# EAGLE design phMeter v4.2 (EAGLE 7.1.0)
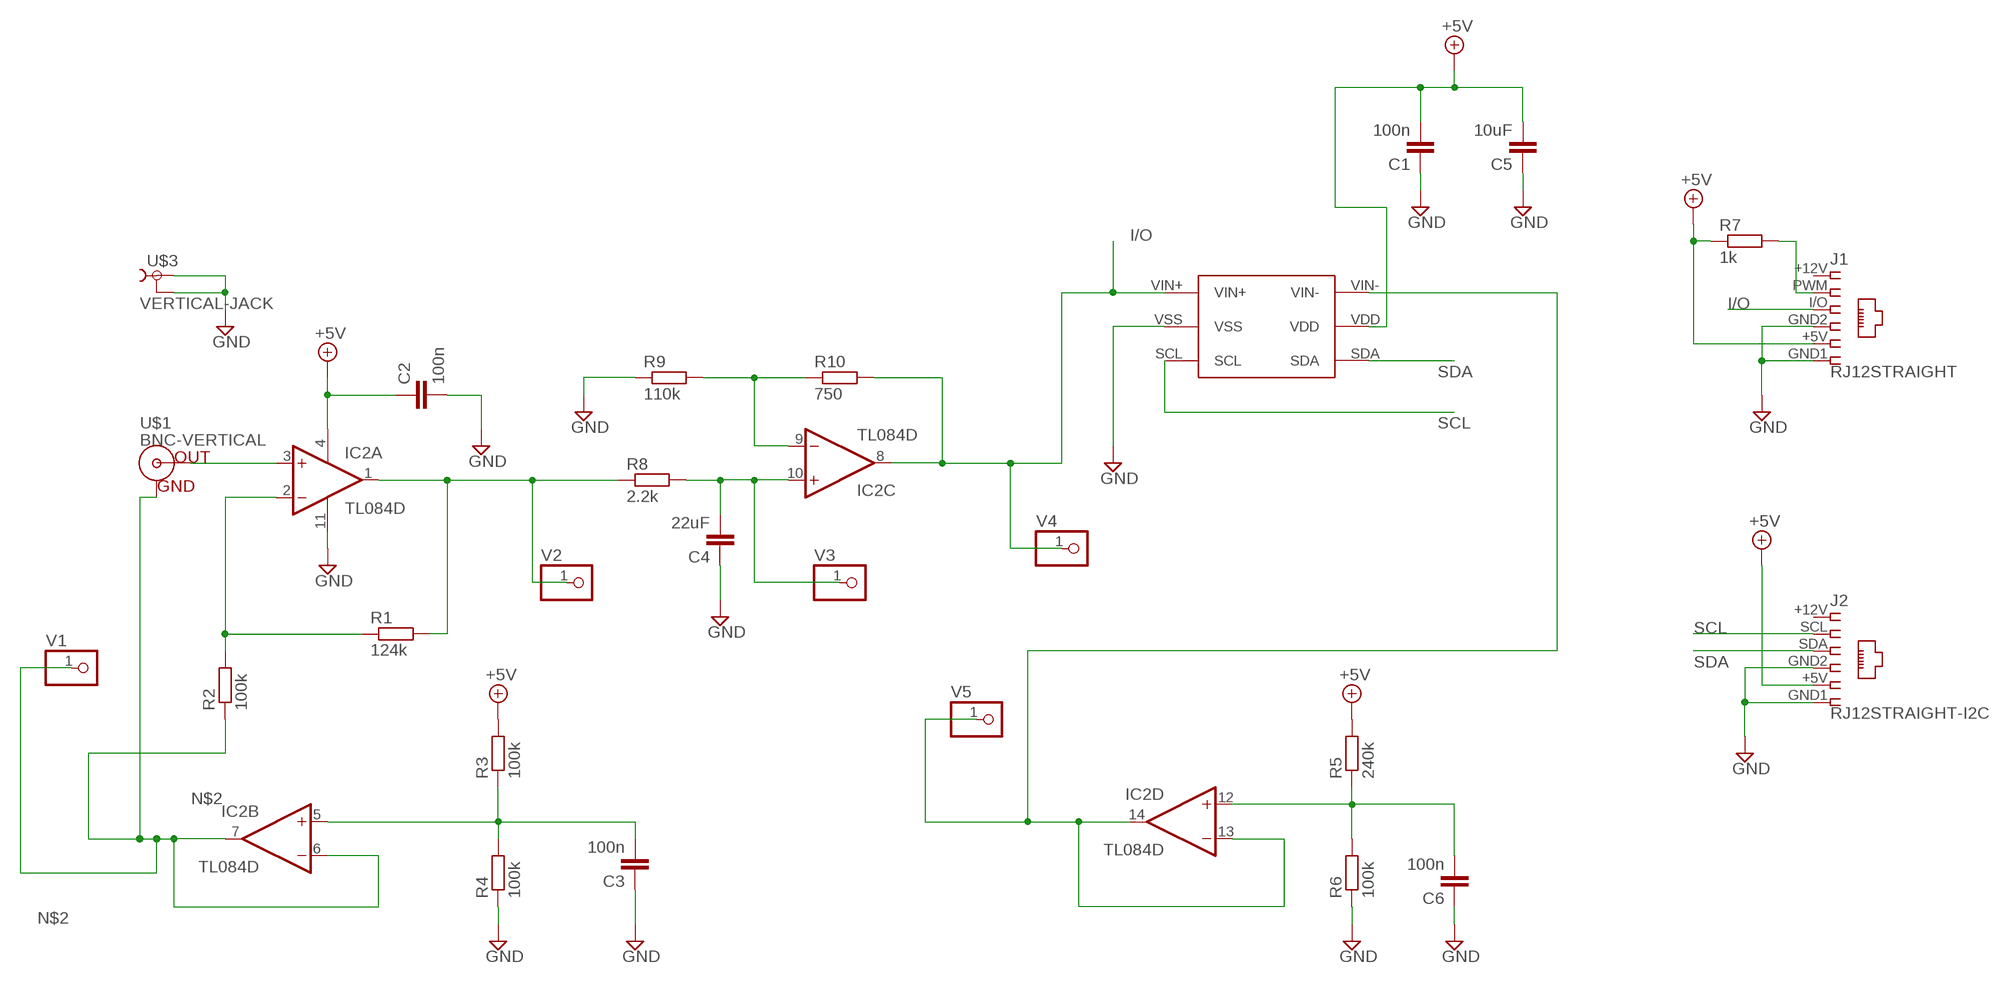
[diagram p0: schematic, sheet 1]

## Parts
C1  100n  C-EUC1206  [C1206]
C2  100n  C-EUC1206  [C1206]
C3  100n  C-EUC1206  [C1206]
C4  22uF  C-EUC1206  [C1206]
C5  10uF  C-EUC1206  [C1206]
C6  100n  C-EUC1206  [C1206]
IC2  TL084D  [SO14]
J1  RJ12STRAIGHT  [RJ12-STRAIGHT]
J2  RJ12STRAIGHT-I2C  [RJ12-STRAIGHT-I2C]
R1  124k  R-EU_R1206  [R1206]
R2  100k  R-EU_R1206  [R1206]
R3  100k  R-EU_R1206  [R1206]
R4  100k  R-EU_R1206  [R1206]
R5  240k  R-EU_R1206  [R1206]
R6  100k  R-EU_R1206  [R1206]
R7  1k  R-EU_R1206  [R1206]
R8  2.2k  R-EU_R1206  [R1206]
R9  110k  R-EU_R1206  [R1206]
R10  750  R-EU_R1206  [R1206]
U$1  BNC-VERTICAL  [BNC-VERTICAL]
U$3  VERTICAL-JACK  [VERTICAL-JACK]
U$5  MCP3425  [SOT-23-6]
V1  PINHD-1X1  [1X01]
V2  PINHD-1X1  [1X01]
V3  PINHD-1X1  [1X01]
V4  PINHD-1X1  [1X01]
V5  PINHD-1X1  [1X01]

## Nets
+5V: C1.2 C2.1 C5.2 IC2.4(P:V+) J1.+5V J2.+5V R3.2 R5.2 R7.1 U$5.VDD
GND: C1.1 C2.2 C3.1 C4.1 C5.1 C6.1 IC2.11(P:V-) J1.GND1 J1.GND2 J2.GND1 J2.GND2 R4.1 R6.1 R9.1 U$3.P$1 U$3.P$2 U$5.VSS
I/O: IC2.8(C:OUT) J1.I/O R10.2 U$5.VIN+ V4.1
N$1: IC2.2(A:-IN) R1.1 R2.2
N$2: IC2.6(B:-IN) IC2.7(B:OUT) R2.1 U$1.G(GND) V1.1
N$3: J1.PWM R7.2
N$4: IC2.13(D:-IN) IC2.14(D:OUT) U$5.VIN- V5.1
N$5: IC2.3(A:+IN) U$1.S(OUT)
N$7: IC2.1(A:OUT) R1.2 R8.1 V2.1
N$9: C3.2 IC2.5(B:+IN) R3.1 R4.2
N$10: C4.2 IC2.10(C:+IN) R8.2 V3.1
N$11: IC2.9(C:-IN) R9.2 R10.1
N$14: C6.2 IC2.12(D:+IN) R5.1 R6.2
SCL: J2.SCL U$5.SCL
SDA: J2.SDA U$5.SDA
Unconnected: J1.+12V J2.+12V

## Library data of the parts
C1-C6 = rcl:C-EU: CAPACITOR, European symbol
IC2 = linear:TL084: OP AMP
J1 J2 = lpatiny:RJ12: CORCOM Modular RJ Jacks No Shield Source: www.tycoelectronics.com .. ENG_DS_1654001_1099_RJ_L_0507.pdf
R1-R10 = resistor:R-EU_: RESISTOR, European symbol
U$1 = phMeter:BNC-VERTICAL
U$3 = phMeter:VERTICAL-JACK
U$5 = phMeter:MCP3425
V1-V5 = pinhead:PINHD-1X1: PIN HEADER

## Net classes
0 default: width 0.457 mm

## Board
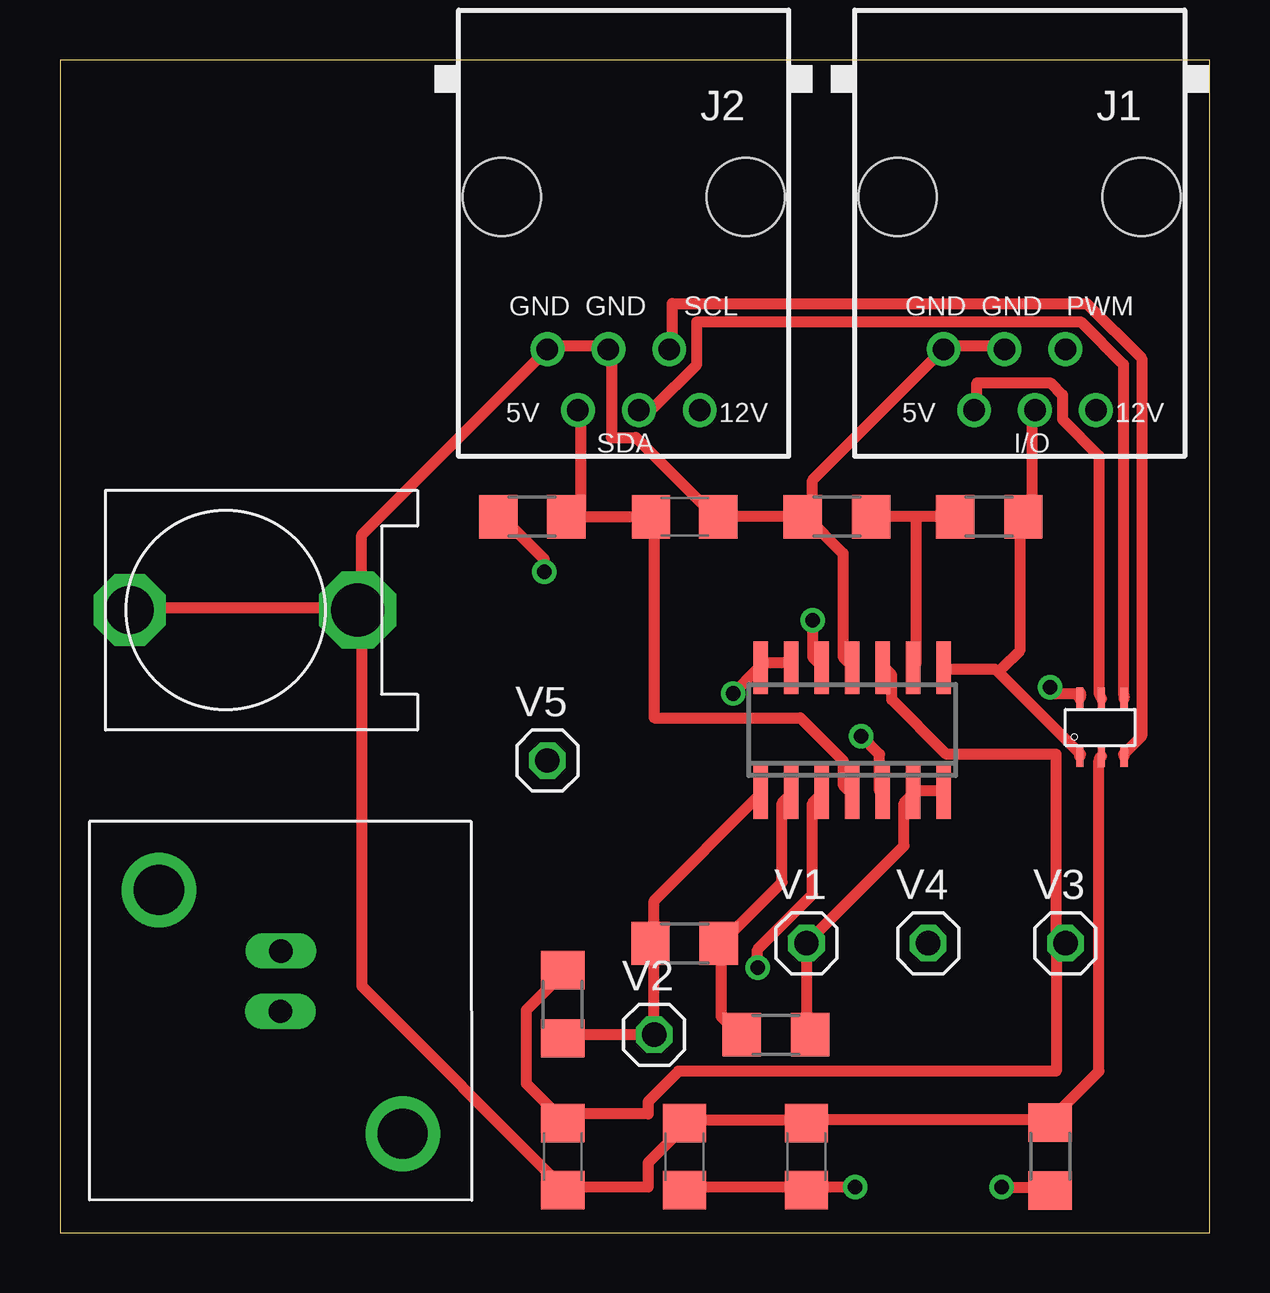
[diagram p1: board, top side]
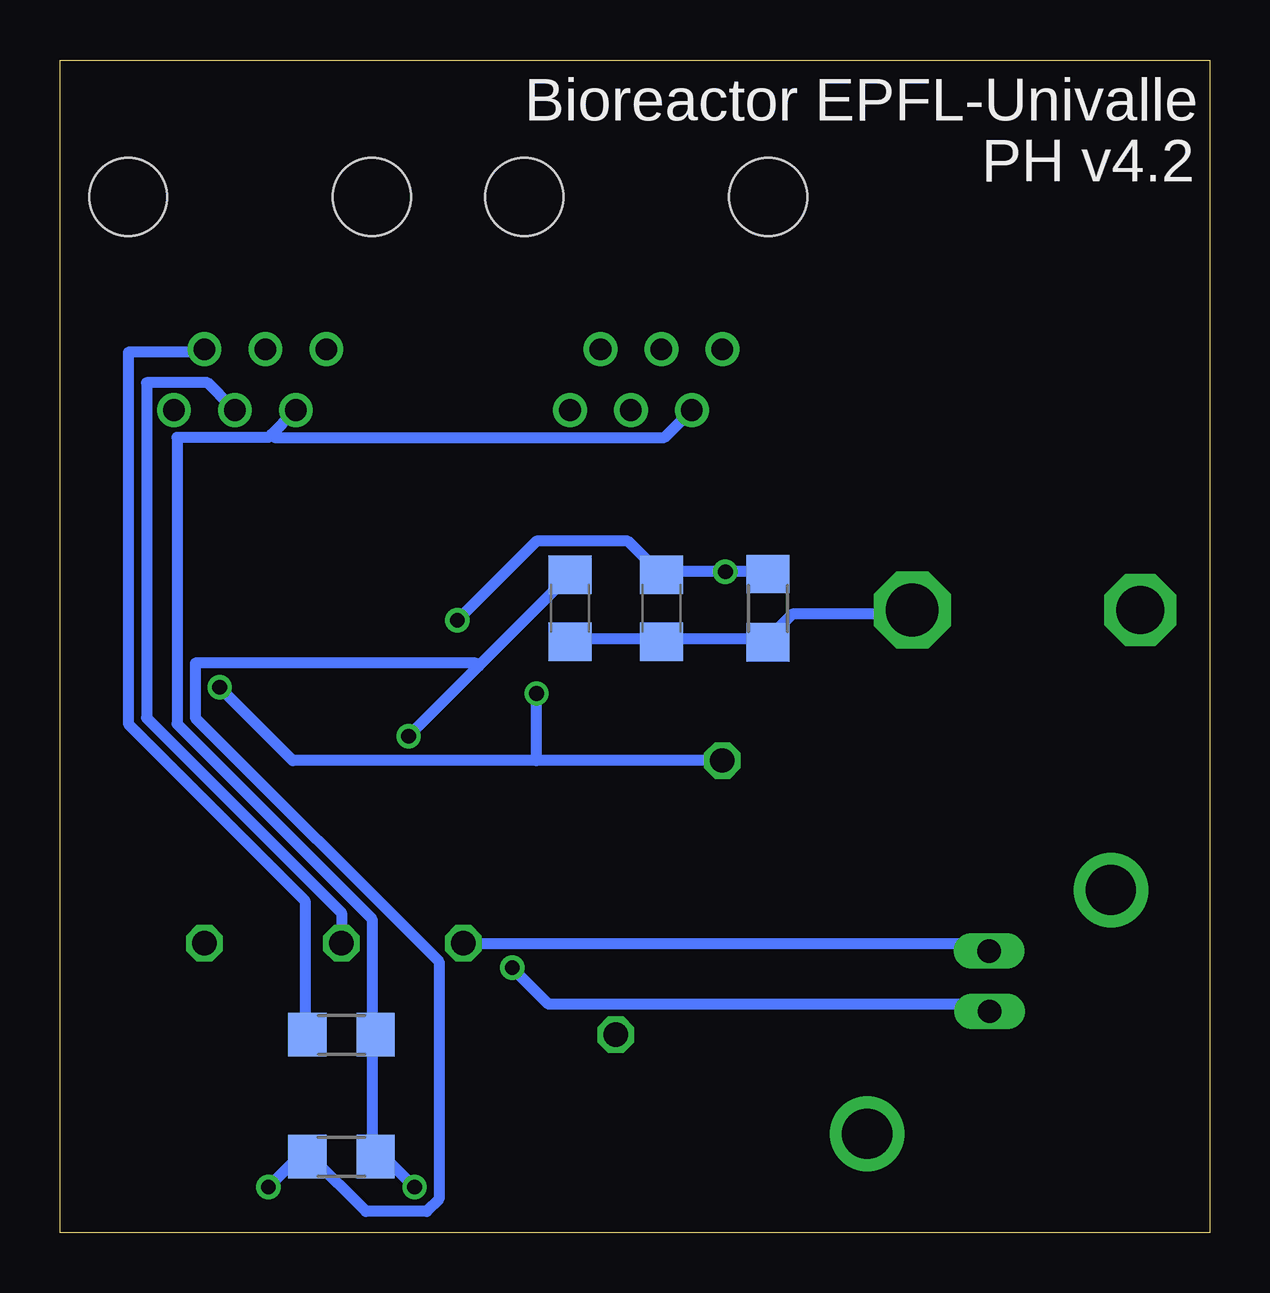
[diagram p2: board, bottom side, seen from below]

Size 47.93 x 48.89 mm. Coordinates in mm from the lower left corner, seen from the top.
Outline: 0,0 47.93,0 47.93,48.89 0,48.89 0,0
Copper layers (1*16): Top 0.035mm / dielectric 1.5mm / Bottom 0.035mm
Design rules "default": minimum track width 10mil, minimum drill 24mil, track to track 8mil, track to pad 8mil, pad to pad 8mil, via to via 8mil, smd to smd 8mil, copper to edge 40mil, drill to drill 8mil, minimum pad ring 10mil, minimum via ring 8mil, stop-mask expansion 4mil, vias tented up to drill 0mil, thermal gap 10mil

### Footprints (pad centres in the part's own frame; a part is rotated, then mirrored left to right if it is on the bottom)
C1206 = smd 1.6 x 1.8: 1 -1.4,0; 2 1.4,0
SO14 = smd 0.6 x 2.2: 1 -3.81,-2.6; 2 -2.54,-2.6; 3 -1.27,-2.6; 4 0,-2.6; 5 1.27,-2.6; 6 2.54,-2.6; 7 3.81,-2.6; 8 3.81,2.6; 9 2.54,2.6; 10 1.27,2.6; 11 0,2.6; 12 -1.27,2.6; 13 -2.54,2.6; 14 -3.81,2.6
RJ12-STRAIGHT = drill 0.9 pad 1.4: +5V 1.905,8.89; +12V -3.175,8.89; GND1 3.175,6.35; GND2 0.635,6.35; I/O -0.635,8.89; PWM -1.905,6.35 | hole 3.251: -5.08,0; 5.08,0
RJ12-STRAIGHT-I2C = drill 0.9 pad 1.4: +5V 1.905,8.89; +12V -3.175,8.89; GND1 3.175,6.35; GND2 0.635,6.35; SCL -1.905,6.35; SDA -0.635,8.89 | hole 3.251: -5.08,0; 5.08,0
R1206 = smd 1.6 x 1.803: 1 -1.422,0; 2 1.422,0
BNC-VERTICAL = drill 0.97 long: G 5.4,-7.94; S 7.92,-7.96 | drill 2.09: P$3 13.02,-2.86; P$4 2.86,-13.02
VERTICAL-JACK = drill 2 octagon: P$1 5,-1 | drill 2.2 octagon: P$2 5,-10.5
SOT-23-6 = smd 0.305 x 0.9: SCL 2.45,-0.45; SDA 2.45,1.95; VDD 1.5,1.95; VIN+ 0.6,-0.45; VIN- 0.6,1.95; VSS 1.5,-0.45
1X01 = drill 1.016 octagon: 1 0,0

### Placement (x,y rotation side)
C1  31.11,3.17 270 top
C2  26.04,29.84 0 top
C3  26.67,26.04 90 bottom
C4  20.95,3.17 90 top
C5  26.04,3.17 270 top
C6  22.86,26.04 90 bottom
IC2  33.02,20.95 0 top
J1  40.01,43.18 180 top
J2  23.49,43.18 180 top
R1  26.04,12.06 180 top
R2  29.84,8.26 180 top
R3  36.2,3.17 0 bottom
R4  41.27,3.17 270 top
R5  19.68,29.84 0 top
R6  18.41,26.04 90 bottom
R7  36.2,8.26 180 bottom
R8  20.95,9.53 90 top
R9  32.39,29.84 0 top
R10  38.73,29.84 0 top
U$1  17.14,17.14 270 top
U$3  1.91,20.95 90 top
U$5  41.91,20.32 0 top
V1  31.11,12.06 0 top
V2  24.76,8.26 0 top
V3  41.91,12.06 0 top
V4  36.2,12.06 0 top
V5  20.32,19.68 0 top

### Tracks (layer width: path | path; a pad name or v marks a point on that pad's centre or on a via)
+5V  (via drill 0.61)
  Top 0.457: 21.72,29.84 21.21,29.84 R5.2 21.72,29.84 | 21.72,29.84 24.51,29.84 C2.1 24.76,29.84 24.76,21.46 30.86,21.46 32.64,19.68 32.64,18.67 32.89,18.41 IC2.4 | 21.72,29.84 21.72,34.16 J2.+5V | 31.11,1.91 26.04,1.91 C5.2 | 31.11,1.91 C1.2 31.11,1.91 | v33.15,1.91 31.11,1.91 | U$5.VDD 43.31,22.48 43.31,32.39 41.78,33.91 41.78,34.93 41.27,35.43 38.23,35.43 38.23,34.42 J1.+5V
  Bottom 0.457: 34.93,8.26 34.93,3.17 R3.2 34.67,3.17 34.42,3.17 v33.15,1.91 | 34.93,8.26 R7.1 34.93,8.26 | 34.93,8.26 34.93,13.08 43.05,21.21 43.05,33.15 39.24,33.15 39.12,33.27 | 39.12,33.27 38.23,34.16 J1.+5V | J2.+5V 21.72,34.16 22.73,33.15 38.99,33.15 39.12,33.27
GND
  Top 0.457: 20.95,1.91 24.51,1.91 24.51,2.92 26.04,4.45 C5.1 26.04,4.7 31.11,4.7 | 20.95,1.91 C4.1 20.95,1.91 | 31.11,4.7 C1.1 31.11,4.7 | 41.27,4.7 43.31,6.73 43.31,19.68 U$5.VSS | 41.27,4.7 R4.1 41.27,4.7 | 41.27,4.7 31.11,4.7 | J1.GND2 39.24,36.96 36.96,36.96 J1.GND1 36.7,36.7 31.37,31.37 31.37,29.84 R9.1 | R9.1 30.86,29.84 27.56,29.84 C2.2 27.3,29.84 24,33.15 22.99,33.15 22.99,36.7 J2.GND2 22.73,36.96 20.45,36.96 J2.GND1 20.19,36.7 12.57,29.08 12.57,26.04 U$3.P$2 | IC2.11 32.89,23.75 32.64,24 32.64,28.32 31.11,29.84 R9.1 | U$3.P$1 2.92,26.04 12.32,26.04 U$3.P$2 | 20.95,1.91 12.57,10.29 12.57,25.78 U$3.P$2
  Bottom 0.457: C3.1 26.54,24.76 22.99,24.76 C6.1 22.73,24.76 18.41,24.76 | 18.41,24.76 R6.1 18.41,24.76 | 18.41,24.76 17.4,25.78 12.57,25.78 U$3.P$2
I/O
  Top 0.457: 39.12,23.37 38.99,23.49 36.96,23.49 IC2.8 | 39.12,23.37 42.55,19.94 U$5.VIN+ | J1.I/O 40.51,34.16 40.51,30.1 40.26,29.84 R10.2 40.01,29.84 40.01,24.26 39.24,23.49 39.12,23.37
  Bottom 0.457: V4.1 36.2,13.34 44.32,21.46 44.32,35.43 41.78,35.43 40.77,34.42 J1.I/O
N$1
  Top 0.457: 27.56,12.06 27.56,9.02 28.32,8.26 R2.2 | 27.56,12.06 R1.1 27.56,12.06 | 27.56,12.06 30.1,14.61 30.1,17.91 30.35,18.16 IC2.2
N$2
  Top 0.457: IC2.7 36.7,18.41 35.69,18.41 IC2.6 35.43,18.16 35.18,17.91 35.18,16.13 V1.1 31.11,8.26 R2.1
  Bottom 0.457: V1.1 9.53,12.06 9.27,11.81 U$1.G
N$3
  Bottom 0.457: R7.2 37.72,8.26 37.72,13.84 45.09,21.21 45.09,36.7 42.04,36.7 J1.PWM
N$4  (via drill 0.61)
  Top 0.457: IC2.13 30.35,23.75 29.34,23.75 IC2.14 29.08,23.49 v28.07,22.48 | v41.27,22.73 41.27,22.48 42.55,22.48 U$5.VIN-
  Bottom 0.457: v41.27,22.73 38.23,19.68 28.07,19.68 | 28.07,19.68 20.45,19.68 V5.1 | 28.07,19.68 v28.07,22.48
N$5  (via drill 0.61)
  Top 0.457: v29.08,11.05 29.08,11.81 31.37,14.1 31.37,17.91 31.62,18.16 IC2.3
  Bottom 0.457: v29.08,11.05 27.56,9.53 9.53,9.53 9.27,9.27 U$1.S
N$7
  Top 0.457: R8.1 20.95,8.26 V2.1 24.76,12.06 | 24.76,12.06 R1.2 24.76,12.06 | 24.76,12.06 24.76,13.84 29.08,18.16 IC2.1
N$9  (via drill 0.61)
  Top 0.457: v39.24,1.91 41.27,1.91 R4.2 | v33.4,20.7 34.16,19.94 34.16,18.41 IC2.5
  Bottom 0.457: v39.24,1.91 37.97,3.17 37.72,3.17 R3.1 37.47,3.17 35.18,0.89 32.64,0.89 32.13,1.4 32.13,11.3 42.29,21.46 42.29,23.75 30.61,23.75 30.48,23.62 | v33.4,20.7 30.48,23.62 | 30.48,23.62 26.8,27.3 C3.2
N$10
  Top 0.457: R8.2 20.95,10.79 19.43,9.27 19.43,6.22 20.95,4.7 C4.2 20.95,4.95 24.51,4.95 24.51,5.46 25.78,6.73 41.53,6.73 41.53,12.06 V3.1 41.78,12.06 41.53,12.32 41.53,19.94 36.96,19.94 34.67,22.22 34.67,23.24 34.42,23.49 IC2.10
N$11
  Top 0.457: 35.69,29.84 37.21,29.84 R10.1 | 35.69,29.84 33.91,29.84 R9.2 | 35.69,29.84 35.69,23.75 IC2.9
N$14  (via drill 0.61)
  Top 0.457: v20.19,27.56 20.19,28.07 18.41,29.84 R5.1 | v31.37,25.53 31.37,24 31.62,23.75 IC2.12
  Bottom 0.457: R6.2 18.41,27.56 v20.19,27.56 22.73,27.56 C6.2 22.99,27.56 24.26,28.83 28.07,28.83 v31.37,25.53
SCL
  Top 0.457: U$5.SCL 44.32,19.94 45.09,20.7 45.09,36.45 42.8,38.73 25.53,38.73 25.53,36.96 J2.SCL
SDA
  Top 0.457: U$5.SDA 44.32,22.48 44.32,36.2 42.55,37.97 26.54,37.97 26.54,36.2 24.76,34.42 24.26,34.42 J2.SDA

### Text on the board
bNames: Bioreactor EPFL-Univalle | PH v4.2